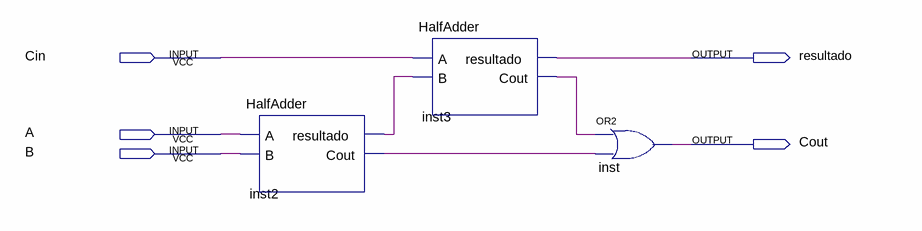
[diagram p0: schematic sheet]
// Quartus schematic FullAdder.bdf as structural Verilog: 3 symbols, 5 pins
module FullAdder (
  input  Cin,
  input  A,
  input  B,
  output resultado,
  output Cout
);

  wire inst2_cout, inst2_resultado, inst3_cout;

  HalfAdder inst2 (.A(A), .B(B), .resultado(inst2_resultado), .Cout(inst2_cout));
  HalfAdder inst3 (.A(Cin), .B(inst2_resultado), .resultado(resultado), .Cout(inst3_cout));
  or inst (Cout, inst3_cout, inst2_cout);
endmodule
